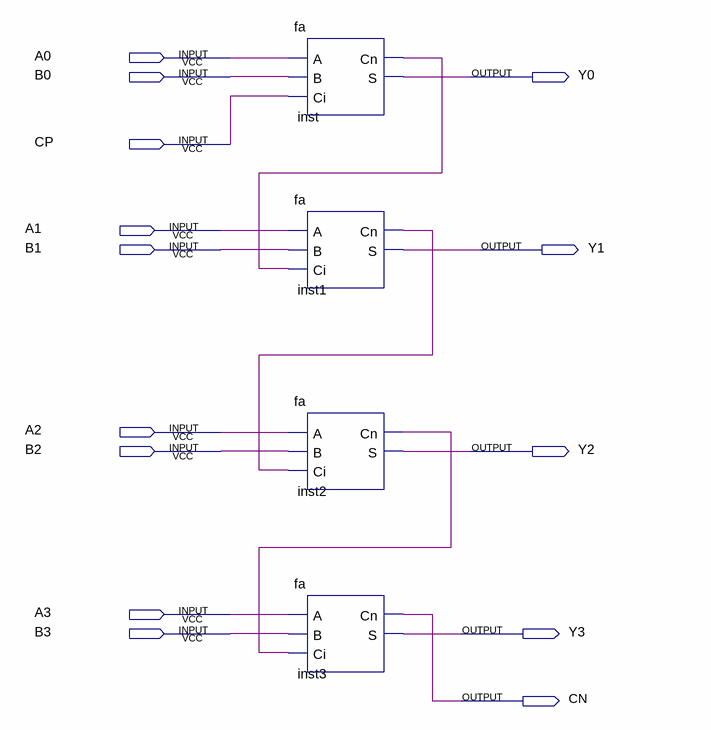
[diagram p0: schematic sheet]
// Quartus schematic adder_4bit.bdf as structural Verilog: 4 symbols, 14 pins
module adder_4bit (
  input  A0,
  input  B0,
  input  CP,
  input  A1,
  input  B1,
  input  A2,
  input  B2,
  input  A3,
  input  B3,
  output Y0,
  output Y1,
  output Y2,
  output Y3,
  output CN
);

  wire inst1_cn, inst2_cn, inst_cn;

  fa inst (.A(A0), .B(B0), .Ci(CP), .Cn(inst_cn), .S(Y0));
  fa inst1 (.A(A1), .B(B1), .Ci(inst_cn), .Cn(inst1_cn), .S(Y1));
  fa inst2 (.A(A2), .B(B2), .Ci(inst1_cn), .Cn(inst2_cn), .S(Y2));
  fa inst3 (.A(A3), .B(B3), .Ci(inst2_cn), .Cn(CN), .S(Y3));
endmodule
